# EAGLE schematic Buzzer Box (EAGLE 8.7.1)
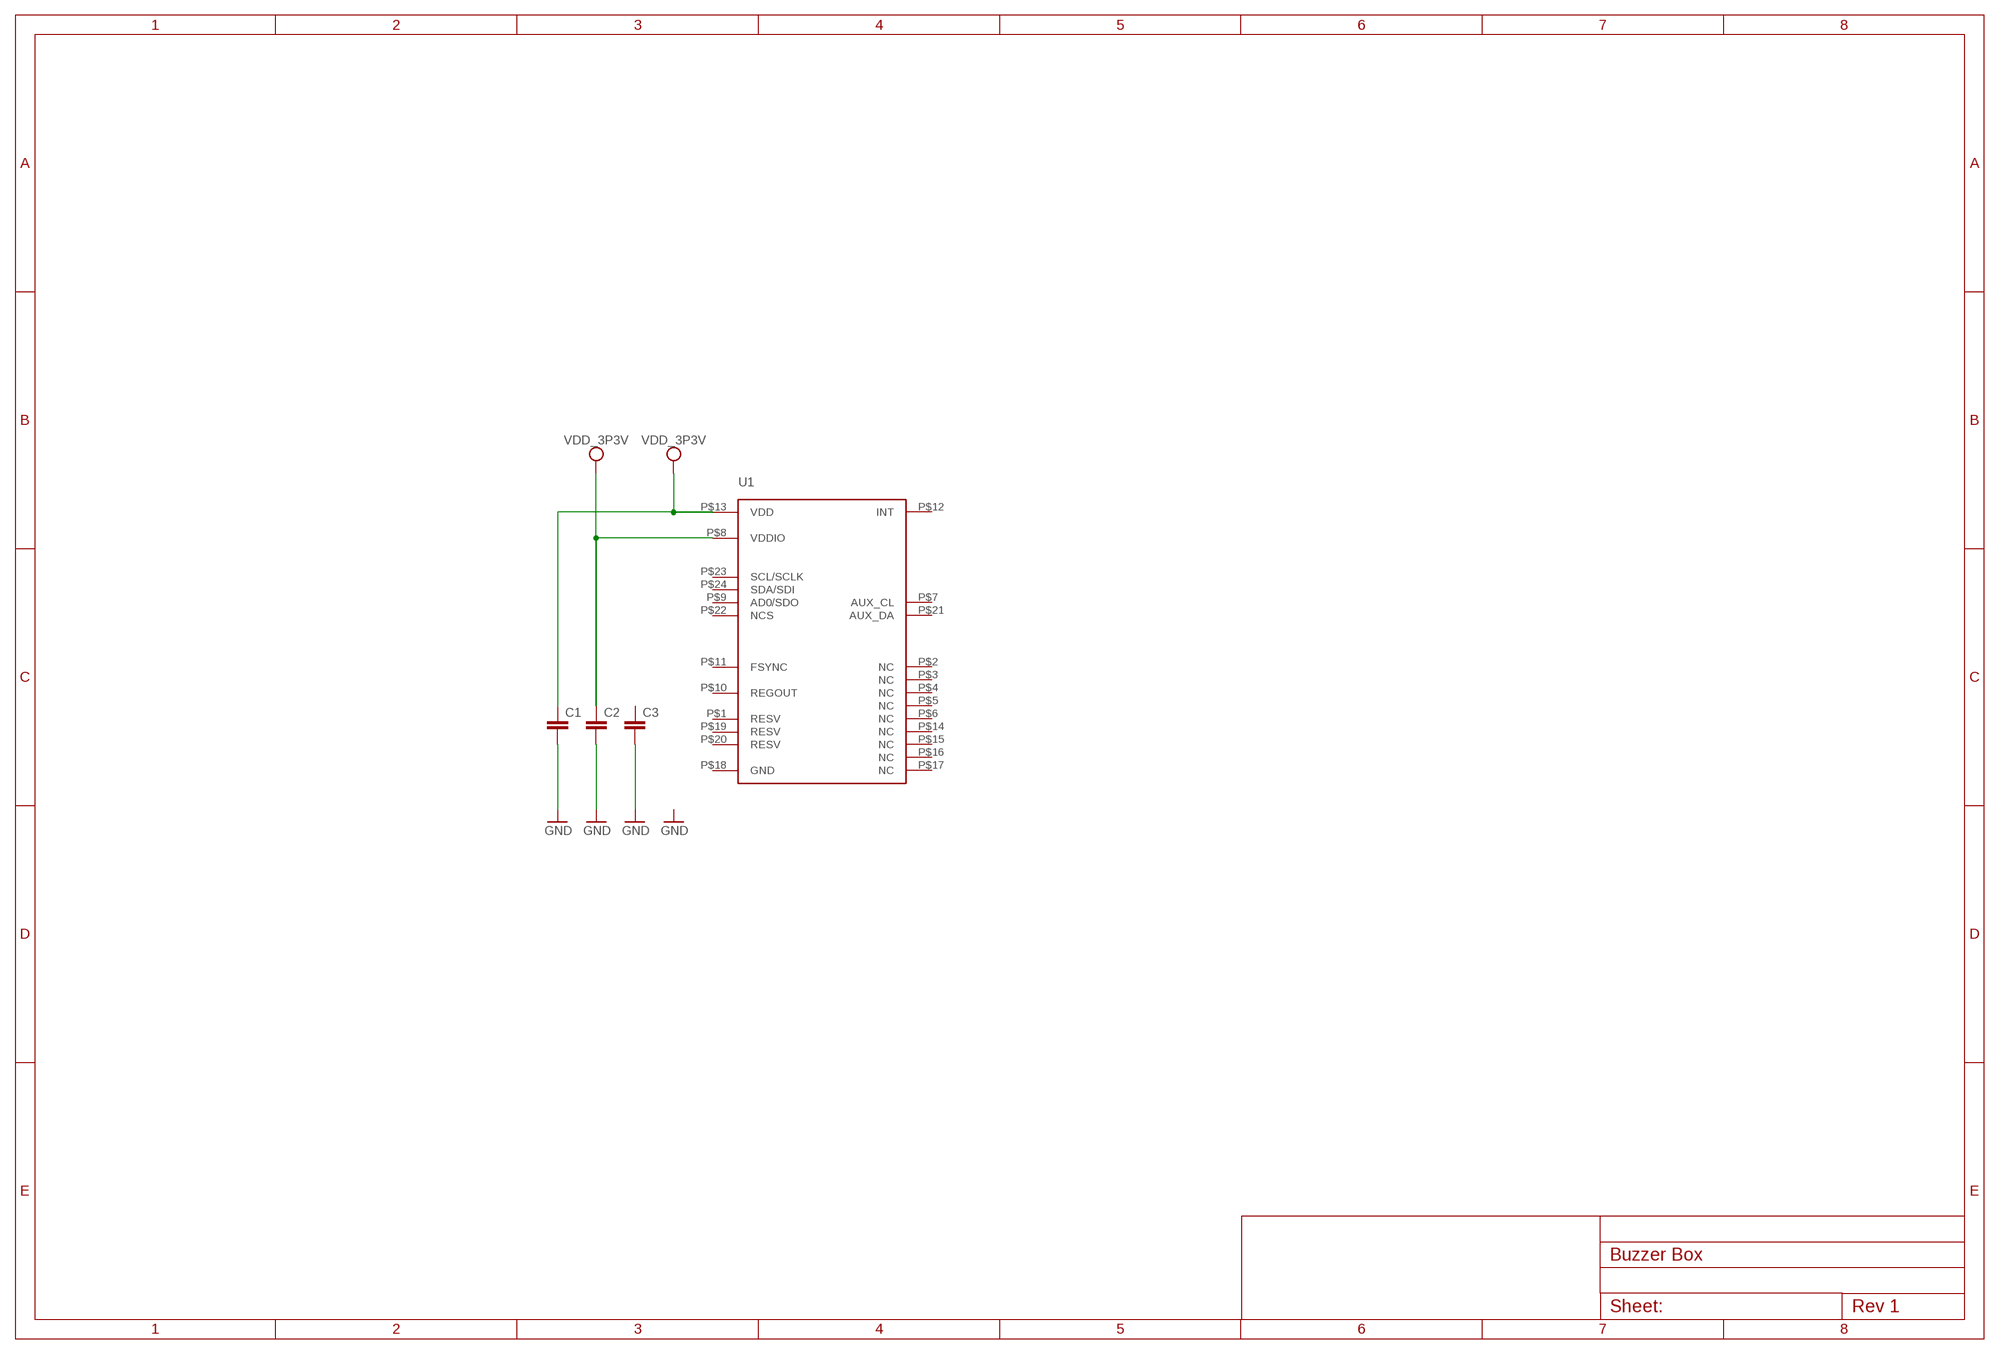
[diagram p0: schematic, sheet 1]

## Parts
C1  C_C0402  [C0402]
C2  C_C0402  [C0402]
C3  C_C0402  [C0402]
U1  MPU-9250  [QFN-3X3MM]

## Nets
GND: C1.2 C2.2 C3.2
SYS_VDD1_3P3V: C1.1 C2.1 U1.P$8(VDDIO) U1.P$13(VDD) ; supply symbol labelled VDD_3P3V
Unconnected: C3.1 U1.P$1(RESV) U1.P$2(NC) U1.P$3(NC) U1.P$4(NC) U1.P$5(NC) U1.P$6(NC) U1.P$7(AUX_CL) U1.P$9(AD0/SDO) U1.P$10(REGOUT) U1.P$11(FSYNC) U1.P$12(INT) U1.P$14(NC) U1.P$15(NC) U1.P$16(NC) U1.P$17(NC) U1.P$18(GND) U1.P$19(RESV) U1.P$20(RESV) U1.P$21(AUX_DA) U1.P$22(NCS) U1.P$23(SCL/SCLK) U1.P$24(SDA/SDI)

## Library data of the parts
C1-C3 = Buzzer Box:C_: Capacitor SMD. Sizes: 0402, 0603 & 0805
U1 = Buzzer Box:MPU-9250